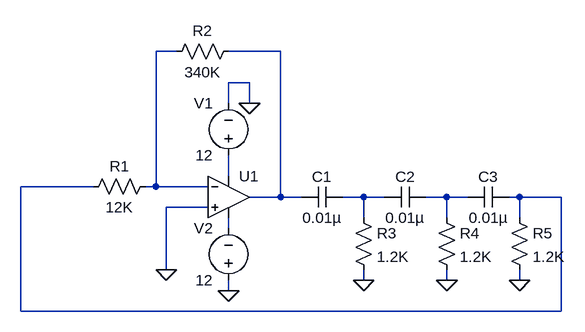
[diagram p0: schematic Opamp RC Phase shift Oscillator2.asc]
Opamp RC Phase shift Oscillator2.asc, the LTspice schematic file:
Version 4
SHEET 1 880 680
WIRE 176 -64 144 -64
WIRE 336 -64 256 -64
WIRE 288 -16 256 -16
WIRE 256 16 256 -16
WIRE 288 16 288 -16
WIRE 256 128 256 96
WIRE 48 144 -64 144
WIRE 144 144 144 -64
WIRE 144 144 128 144
WIRE 224 144 144 144
WIRE 336 160 336 -64
WIRE 336 160 288 160
WIRE 368 160 336 160
WIRE 464 160 432 160
WIRE 496 160 464 160
WIRE 592 160 560 160
WIRE 624 160 592 160
WIRE 704 160 688 160
WIRE 768 160 704 160
WIRE 224 176 160 176
WIRE 464 192 464 160
WIRE 592 192 592 160
WIRE 704 192 704 160
WIRE 256 208 256 192
WIRE 160 272 160 176
WIRE 464 288 464 272
WIRE 592 288 592 272
WIRE 704 288 704 272
WIRE 256 304 256 288
WIRE -64 336 -64 144
WIRE 768 336 768 160
WIRE 768 336 -64 336
FLAG 160 272 0
FLAG 464 288 0
FLAG 592 288 0
FLAG 704 288 0
FLAG 288 16 0
FLAG 256 304 0
SYMBOL Opamps\\UniversalOpamp2 256 160 R0
SYMATTR InstName U1
SYMBOL res 144 128 R90
WINDOW 0 0 56 VBottom 2
WINDOW 3 32 56 VTop 2
SYMATTR InstName R1
SYMATTR Value 12K
SYMBOL cap 432 144 R90
WINDOW 0 0 32 VBottom 2
WINDOW 3 32 32 VTop 2
SYMATTR InstName C1
SYMATTR Value 0.01µ
SYMBOL cap 560 144 R90
WINDOW 0 0 32 VBottom 2
WINDOW 3 32 32 VTop 2
SYMATTR InstName C2
SYMATTR Value 0.01µ
SYMBOL cap 688 144 R90
WINDOW 0 0 32 VBottom 2
WINDOW 3 32 32 VTop 2
SYMATTR InstName C3
SYMATTR Value 0.01µ
SYMBOL res 272 -80 R90
WINDOW 0 0 56 VBottom 2
WINDOW 3 32 56 VTop 2
SYMATTR InstName R2
SYMATTR Value 340K
SYMBOL res 448 176 R0
SYMATTR InstName R3
SYMATTR Value 1.2K
SYMBOL res 576 176 R0
SYMATTR InstName R4
SYMATTR Value 1.2K
SYMBOL res 688 176 R0
SYMATTR InstName R5
SYMATTR Value 1.2K
SYMBOL voltage 256 112 R180
WINDOW 0 24 96 Left 2
WINDOW 3 24 16 Left 2
WINDOW 123 0 0 Left 2
WINDOW 39 0 0 Left 2
SYMATTR InstName V1
SYMATTR Value 12
SYMBOL voltage 256 304 R180
WINDOW 0 24 96 Left 2
WINDOW 3 24 16 Left 2
WINDOW 123 0 0 Left 2
WINDOW 39 0 0 Left 2
SYMATTR InstName V2
SYMATTR Value 12

The netlist it stands for:
* Opamp RC Phase shift Oscillator2.asc
XU1 0 N001 N003 N007 N002 level.2 Avol=1Meg GBW=10Meg Slew=10Meg ilimit=25m rail=0 Vos=0 phimargin=45 en=0 enk=0 in=0 ink=0 Rin=500Meg  ; pins IN+ IN- V+ V- OUT
R1 N001 N004 12K
C1 N005 N002 0.01µ
C2 N006 N005 0.01µ
C3 N004 N006 0.01µ
R2 N002 N001 340K
R3 N005 0 1.2K
R4 N006 0 1.2K
R5 N004 0 1.2K
V1 N003 0 12
V2 0 N007 12
.lib UniversalOpamps2.sub
.backanno
.end